# Altium schematic sheet Espectrometro_Bank.SchDoc
size A4
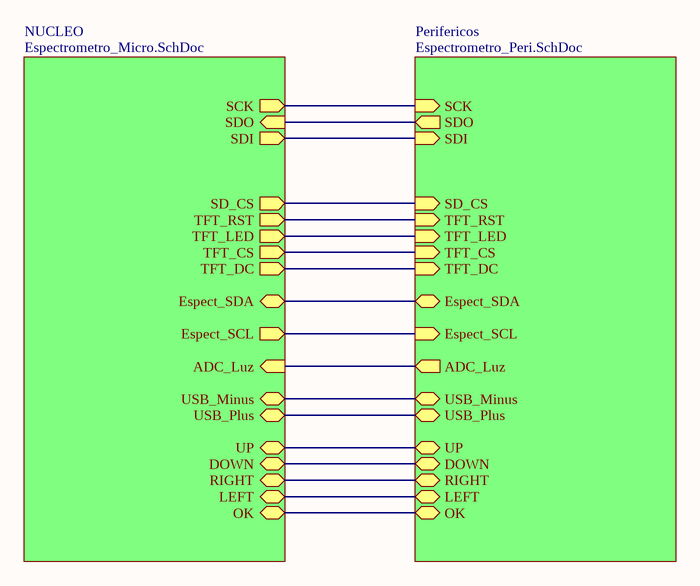
[diagram p0: Espectrometro_Bank.SchDoc]

## Sub-sheets
NUCLEO = Espectrometro_Micro.SchDoc: SCK (out), SDO (in), SDI (out), TFT_RST (out), TFT_LED (out), TFT_CS (out), SD_CS (out), Espect_SCL (out), ADC_Luz (in), Espect_SDA (bidir), TFT_DC (out), USB_Plus (bidir), USB_Minus (bidir), RIGHT (bidir), LEFT (bidir), DOWN (bidir), UP (bidir), OK (bidir)
Perifericos = Espectrometro_Peri.SchDoc: SCK (in), SDO (out), SDI (in), TFT_RST (in), TFT_LED (in), TFT_CS (in), SD_CS (in), Espect_SCL (in), Espect_SDA (bidir), ADC_Luz (out), TFT_DC (in), USB_Plus (bidir), USB_Minus (bidir), UP (bidir), DOWN (bidir), RIGHT (bidir), LEFT (bidir), OK (bidir)

## Nets
(unnamed): sheet NUCLEO/SCK, sheet Perifericos/SCK
(unnamed): sheet NUCLEO/SDO, sheet Perifericos/SDO
(unnamed): sheet NUCLEO/SDI, sheet Perifericos/SDI
(unnamed): sheet NUCLEO/TFT_RST, sheet Perifericos/TFT_RST
(unnamed): sheet NUCLEO/TFT_LED, sheet Perifericos/TFT_LED
(unnamed): sheet NUCLEO/TFT_CS, sheet Perifericos/TFT_CS
(unnamed): sheet NUCLEO/SD_CS, sheet Perifericos/SD_CS
(unnamed): sheet NUCLEO/Espect_SCL, sheet Perifericos/Espect_SCL
(unnamed): sheet NUCLEO/ADC_Luz, sheet Perifericos/ADC_Luz
(unnamed): sheet NUCLEO/Espect_SDA, sheet Perifericos/Espect_SDA
(unnamed): sheet NUCLEO/TFT_DC, sheet Perifericos/TFT_DC
(unnamed): sheet NUCLEO/USB_Plus, sheet Perifericos/USB_Plus
(unnamed): sheet NUCLEO/USB_Minus, sheet Perifericos/USB_Minus
(unnamed): sheet NUCLEO/RIGHT, sheet Perifericos/RIGHT
(unnamed): sheet NUCLEO/LEFT, sheet Perifericos/LEFT
(unnamed): sheet NUCLEO/DOWN, sheet Perifericos/DOWN
(unnamed): sheet NUCLEO/UP, sheet Perifericos/UP
(unnamed): sheet NUCLEO/OK, sheet Perifericos/OK